# EAGLE design LED segment (EAGLE 6.5.0)
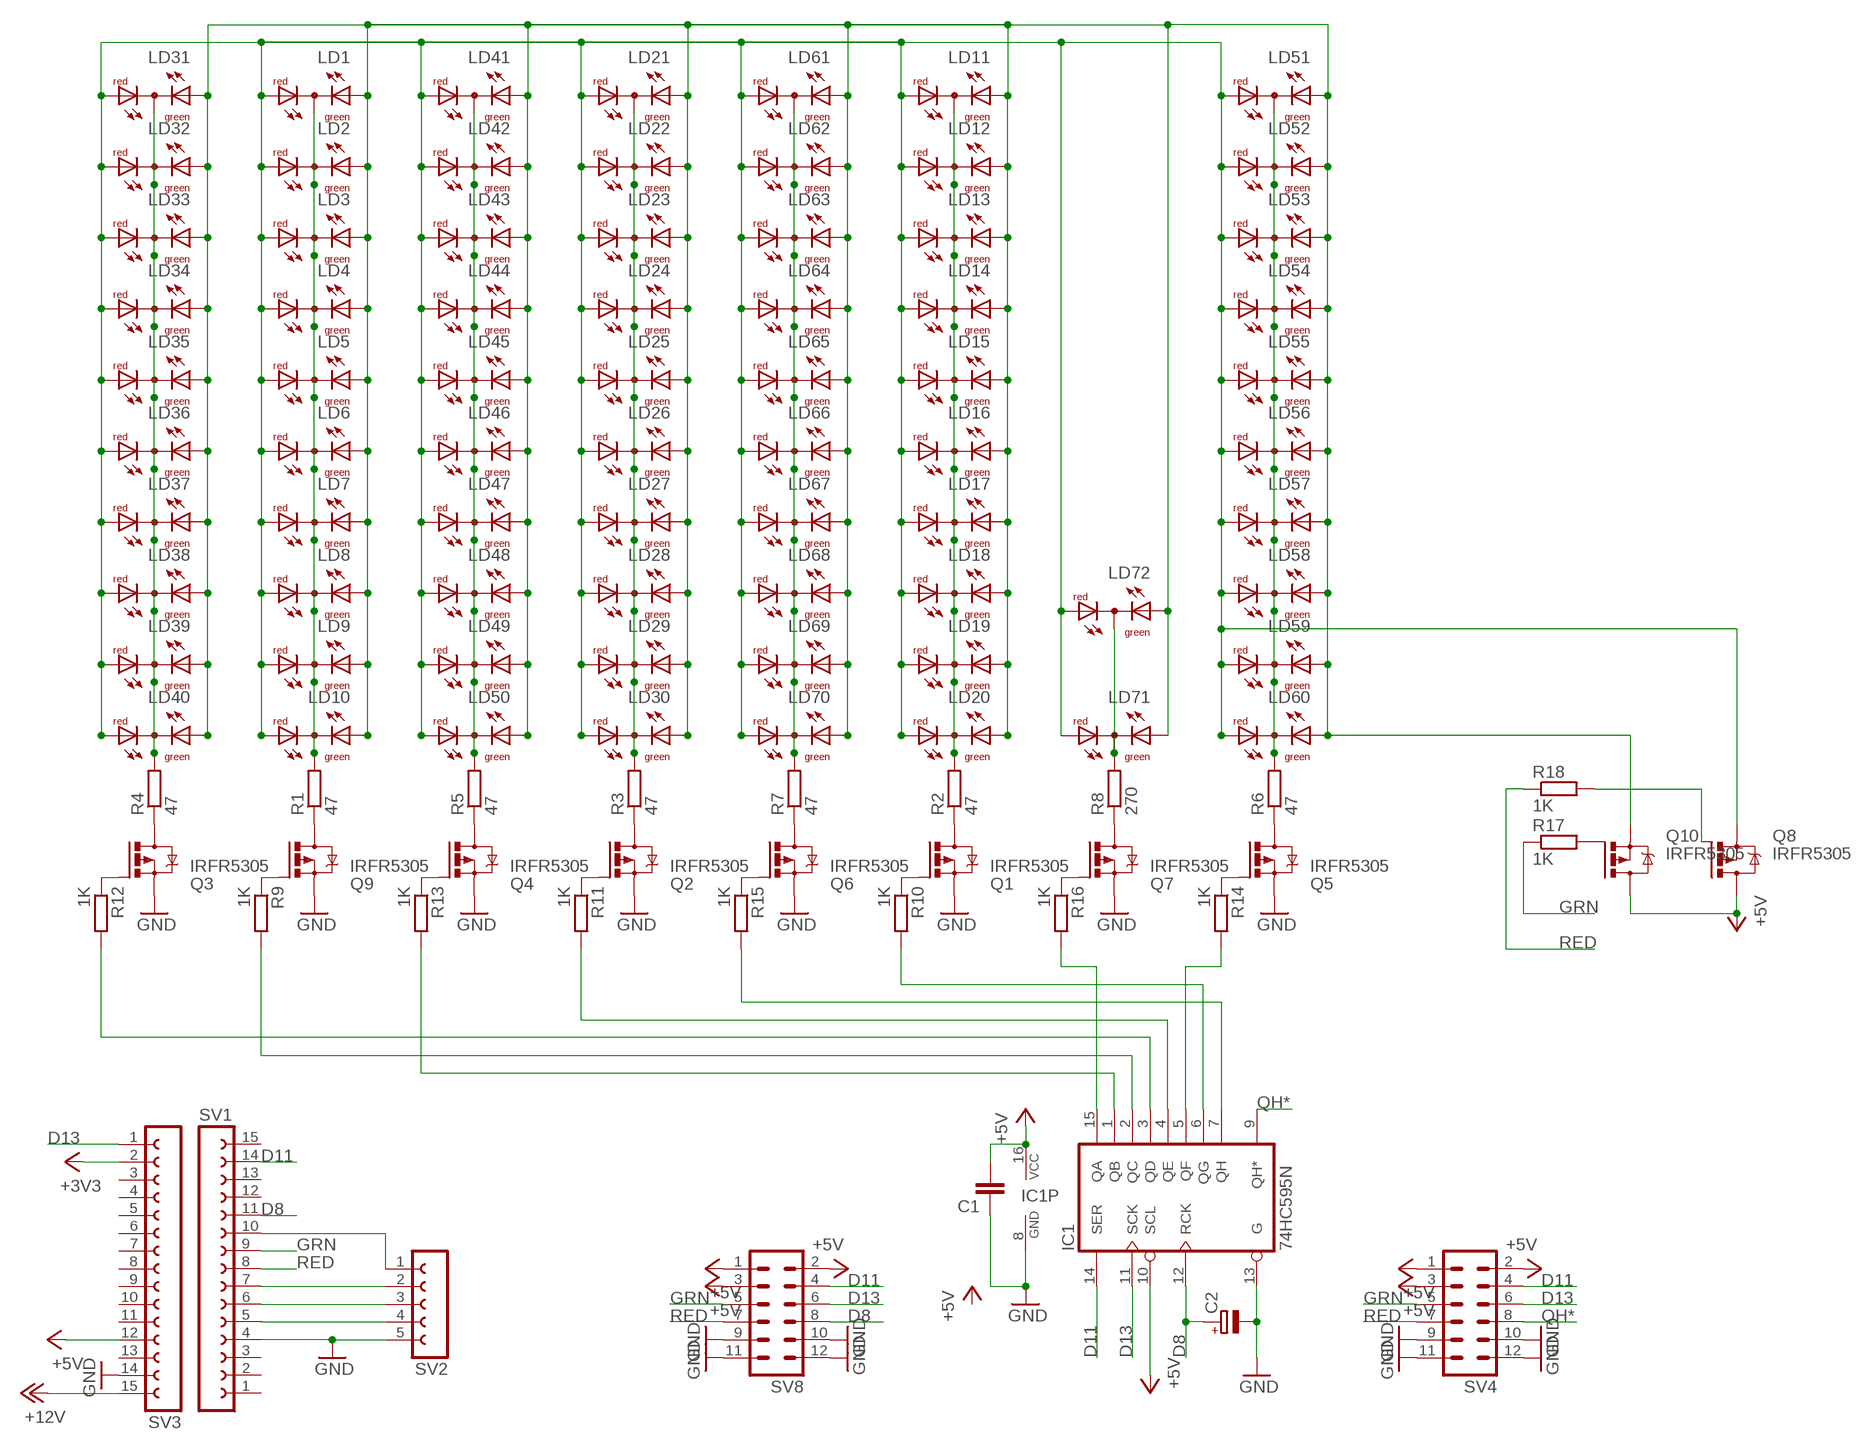
[diagram p0: schematic, sheet 1]

## Parts
C1  C-EU050-030X075  [C050-030X075]
C2  CPOL-EUE2.5-7  [E2,5-7]
IC1  74HC595N  [DIL16]
LD1  DUOLED-RG-C  [DUOLED-C-5MM]
LD2  DUOLED-RG-C  [DUOLED-C-5MM]
LD3  DUOLED-RG-C  [DUOLED-C-5MM]
LD4  DUOLED-RG-C  [DUOLED-C-5MM]
LD5  DUOLED-RG-C  [DUOLED-C-5MM]
LD6  DUOLED-RG-C  [DUOLED-C-5MM]
LD7  DUOLED-RG-C  [DUOLED-C-5MM]
LD8  DUOLED-RG-C  [DUOLED-C-5MM]
LD9  DUOLED-RG-C  [DUOLED-C-5MM]
LD10  DUOLED-RG-C  [DUOLED-C-5MM]
LD11  DUOLED-RG-C  [DUOLED-C-5MM]
LD12  DUOLED-RG-C  [DUOLED-C-5MM]
LD13  DUOLED-RG-C  [DUOLED-C-5MM]
LD14  DUOLED-RG-C  [DUOLED-C-5MM]
LD15  DUOLED-RG-C  [DUOLED-C-5MM]
LD16  DUOLED-RG-C  [DUOLED-C-5MM]
LD17  DUOLED-RG-C  [DUOLED-C-5MM]
LD18  DUOLED-RG-C  [DUOLED-C-5MM]
LD19  DUOLED-RG-C  [DUOLED-C-5MM]
LD20  DUOLED-RG-C  [DUOLED-C-5MM]
LD21  DUOLED-RG-C  [DUOLED-C-5MM]
LD22  DUOLED-RG-C  [DUOLED-C-5MM]
LD23  DUOLED-RG-C  [DUOLED-C-5MM]
LD24  DUOLED-RG-C  [DUOLED-C-5MM]
LD25  DUOLED-RG-C  [DUOLED-C-5MM]
LD26  DUOLED-RG-C  [DUOLED-C-5MM]
LD27  DUOLED-RG-C  [DUOLED-C-5MM]
LD28  DUOLED-RG-C  [DUOLED-C-5MM]
LD29  DUOLED-RG-C  [DUOLED-C-5MM]
LD30  DUOLED-RG-C  [DUOLED-C-5MM]
LD31  DUOLED-RG-C  [DUOLED-C-5MM]
LD32  DUOLED-RG-C  [DUOLED-C-5MM]
LD33  DUOLED-RG-C  [DUOLED-C-5MM]
LD34  DUOLED-RG-C  [DUOLED-C-5MM]
LD35  DUOLED-RG-C  [DUOLED-C-5MM]
LD36  DUOLED-RG-C  [DUOLED-C-5MM]
LD37  DUOLED-RG-C  [DUOLED-C-5MM]
LD38  DUOLED-RG-C  [DUOLED-C-5MM]
LD39  DUOLED-RG-C  [DUOLED-C-5MM]
LD40  DUOLED-RG-C  [DUOLED-C-5MM]
LD41  DUOLED-RG-C  [DUOLED-C-5MM]
LD42  DUOLED-RG-C  [DUOLED-C-5MM]
LD43  DUOLED-RG-C  [DUOLED-C-5MM]
LD44  DUOLED-RG-C  [DUOLED-C-5MM]
LD45  DUOLED-RG-C  [DUOLED-C-5MM]
LD46  DUOLED-RG-C  [DUOLED-C-5MM]
LD47  DUOLED-RG-C  [DUOLED-C-5MM]
LD48  DUOLED-RG-C  [DUOLED-C-5MM]
LD49  DUOLED-RG-C  [DUOLED-C-5MM]
LD50  DUOLED-RG-C  [DUOLED-C-5MM]
LD51  DUOLED-RG-C  [DUOLED-C-5MM]
LD52  DUOLED-RG-C  [DUOLED-C-5MM]
LD53  DUOLED-RG-C  [DUOLED-C-5MM]
LD54  DUOLED-RG-C  [DUOLED-C-5MM]
LD55  DUOLED-RG-C  [DUOLED-C-5MM]
LD56  DUOLED-RG-C  [DUOLED-C-5MM]
LD57  DUOLED-RG-C  [DUOLED-C-5MM]
LD58  DUOLED-RG-C  [DUOLED-C-5MM]
LD59  DUOLED-RG-C  [DUOLED-C-5MM]
LD60  DUOLED-RG-C  [DUOLED-C-5MM]
LD61  DUOLED-RG-C  [DUOLED-C-5MM]
LD62  DUOLED-RG-C  [DUOLED-C-5MM]
LD63  DUOLED-RG-C  [DUOLED-C-5MM]
LD64  DUOLED-RG-C  [DUOLED-C-5MM]
LD65  DUOLED-RG-C  [DUOLED-C-5MM]
LD66  DUOLED-RG-C  [DUOLED-C-5MM]
LD67  DUOLED-RG-C  [DUOLED-C-5MM]
LD68  DUOLED-RG-C  [DUOLED-C-5MM]
LD69  DUOLED-RG-C  [DUOLED-C-5MM]
LD70  DUOLED-RG-C  [DUOLED-C-5MM]
LD71  DUOLED-RG-C  [DUOLED-C-5MM]
LD72  DUOLED-RG-C  [DUOLED-C-5MM]
Q1  IRFR5305  [D-PAK_TO252AA]
Q2  IRFR5305  [D-PAK_TO252AA]
Q3  IRFR5305  [D-PAK_TO252AA]
Q4  IRFR5305  [D-PAK_TO252AA]
Q5  IRFR5305  [D-PAK_TO252AA]
Q6  IRFR5305  [D-PAK_TO252AA]
Q7  IRFR5305  [D-PAK_TO252AA]
Q8  IRFR5305  [D-PAK_TO252AA]
Q9  IRFR5305  [D-PAK_TO252AA]
Q10  IRFR5305  [D-PAK_TO252AA]
R1  47  R-EU_0204/7  [0204/7]
R2  47  R-EU_0204/7  [0204/7]
R3  47  R-EU_0204/7  [0204/7]
R4  47  R-EU_0204/7  [0204/7]
R5  47  R-EU_0204/7  [0204/7]
R6  47  R-EU_0204/7  [0204/7]
R7  47  R-EU_0207/5V  [0207/5V]
R8  270  R-EU_0204/7  [0204/7]
R9  1K  R-EU_0204/7  [0204/7]
R10  1K  R-EU_0204/7  [0204/7]
R11  1K  R-EU_0204/7  [0204/7]
R12  1K  R-EU_0204/7  [0204/7]
R13  1K  R-EU_0204/7  [0204/7]
R14  1K  R-EU_0204/7  [0204/7]
R15  1K  R-EU_0204/7  [0204/7]
R16  1K  R-EU_0204/7  [0204/7]
R17  1K  R-EU_0204/7  [0204/7]
R18  1K  R-EU_0204/7  [0204/7]
SV1  FE15-1  [FE15]
SV2  FE05-1  [FE05-1]
SV3  FE15-1  [FE15]
SV4  MA06-2  [MA06-2]
SV8  MA06-2  [MA06-2]

## Nets
+3V3: SV3.2
+5V: C1.2 IC1.10(SCL) IC1.16(VCC) Q8.4(D) Q10.4(D) SV3.12 SV4.1 SV4.2 SV4.3 SV8.1 SV8.2 SV8.3
+12V: SV3.15
D8: C2.+ IC1.12(RCK) SV1.11 SV8.8
D11: IC1.14(SER) SV1.14 SV4.4 SV8.4
D13: IC1.11(SCK) SV3.1 SV4.6 SV8.6
GND: C1.1 C2.- IC1.8(GND) IC1.13(G) Q1.3(S) Q2.3(S) Q3.3(S) Q4.3(S) Q5.3(S) Q6.3(S) Q7.3(S) Q9.3(S) SV1.4 SV2.5 SV3.14 SV4.9 SV4.10 SV4.11 SV4.12 SV8.9 SV8.10 SV8.11 SV8.12
GRN: R17.1 SV1.9 SV4.5 SV8.5
N$1: IC1.7(QH) R15.2
N$2: LD1.C LD2.C LD3.C LD4.C LD5.C LD6.C LD7.C LD8.C LD9.C LD10.C R1.2
N$3: IC1.5(QF) R14.2
N$4: Q9.4(D) R1.1
N$5: LD11.C LD12.C LD13.C LD14.C LD15.C LD16.C LD17.C LD18.C LD19.C LD20.C R2.2
N$6: Q1.4(D) R2.1
N$7: Q2.4(D) R3.1
N$8: LD21.C LD22.C LD23.C LD24.C LD25.C LD26.C LD27.C LD28.C LD29.C LD30.C R3.2
N$9: Q3.4(D) R4.1
N$10: Q4.4(D) R5.1
N$11: LD31.C LD32.C LD33.C LD34.C LD35.C LD36.C LD37.C LD38.C LD39.C LD40.C R4.2
N$12: Q5.4(D) R6.1
N$13: Q6.4(D) R7.1
N$14: LD41.C LD42.C LD43.C LD44.C LD45.C LD46.C LD47.C LD48.C LD49.C LD50.C R5.2
N$15: Q7.4(D) R8.1
N$16: LD51.C LD52.C LD53.C LD54.C LD55.C LD56.C LD57.C LD58.C LD59.C LD60.C R6.2
N$18: LD1.AR LD2.AR LD3.AR LD4.AR LD5.AR LD6.AR LD7.AR LD8.AR LD9.AR LD10.AR LD11.AR LD12.AR LD13.AR LD14.AR LD15.AR LD16.AR LD17.AR LD18.AR LD19.AR LD20.AR LD21.AR LD22.AR LD23.AR LD24.AR LD25.AR LD26.AR LD27.AR LD28.AR LD29.AR LD30.AR LD31.AR LD32.AR LD33.AR LD34.AR LD35.AR LD36.AR LD37.AR LD38.AR LD39.AR LD40.AR LD41.AR LD42.AR LD43.AR LD44.AR LD45.AR LD46.AR LD47.AR LD48.AR LD49.AR LD50.AR LD51.AR LD52.AR LD53.AR LD54.AR LD55.AR LD56.AR LD57.AR LD58.AR LD59.AR LD60.AR LD61.AR LD62.AR LD63.AR LD64.AR LD65.AR LD66.AR LD67.AR LD68.AR LD69.AR LD70.AR LD71.AR LD72.AR Q8.3(S)
N$19: LD1.AX(AG) LD2.AX(AG) LD3.AX(AG) LD4.AX(AG) LD5.AX(AG) LD6.AX(AG) LD7.AX(AG) LD8.AX(AG) LD9.AX(AG) LD10.AX(AG) LD11.AX(AG) LD12.AX(AG) LD13.AX(AG) LD14.AX(AG) LD15.AX(AG) LD16.AX(AG) LD17.AX(AG) LD18.AX(AG) LD19.AX(AG) LD20.AX(AG) LD21.AX(AG) LD22.AX(AG) LD23.AX(AG) LD24.AX(AG) LD25.AX(AG) LD26.AX(AG) LD27.AX(AG) LD28.AX(AG) LD29.AX(AG) LD30.AX(AG) LD31.AX(AG) LD32.AX(AG) LD33.AX(AG) LD34.AX(AG) LD35.AX(AG) LD36.AX(AG) LD37.AX(AG) LD38.AX(AG) LD39.AX(AG) LD40.AX(AG) LD41.AX(AG) LD42.AX(AG) LD43.AX(AG) LD44.AX(AG) LD45.AX(AG) LD46.AX(AG) LD47.AX(AG) LD48.AX(AG) LD49.AX(AG) LD50.AX(AG) LD51.AX(AG) LD52.AX(AG) LD53.AX(AG) LD54.AX(AG) LD55.AX(AG) LD56.AX(AG) LD57.AX(AG) LD58.AX(AG) LD59.AX(AG) LD60.AX(AG) LD61.AX(AG) LD62.AX(AG) LD63.AX(AG) LD64.AX(AG) LD65.AX(AG) LD66.AX(AG) LD67.AX(AG) LD68.AX(AG) LD69.AX(AG) LD70.AX(AG) LD71.AX(AG) LD72.AX(AG) Q10.3(S)
N$20: LD61.C LD62.C LD63.C LD64.C LD65.C LD66.C LD67.C LD68.C LD69.C LD70.C R7.2
N$22: LD71.C LD72.C R8.2
N$24: IC1.1(QB) R13.2
N$25: Q9.1(G) R9.1
N$26: Q1.1(G) R10.1
N$27: Q2.1(G) R11.1
N$28: Q3.1(G) R12.1
N$29: Q4.1(G) R13.1
N$30: Q5.1(G) R14.1
N$31: Q6.1(G) R15.1
N$32: Q7.1(G) R16.1
N$34: IC1.15(QA) R16.2
N$35: IC1.6(QG) R10.2
N$37: IC1.4(QE) R11.2
N$38: IC1.3(QD) R12.2
N$39: IC1.2(QC) R9.2
N$41: Q10.1(G) R17.2
N$42: Q8.1(G) R18.2
N$50: SV1.7 SV2.2
N$51: SV1.6 SV2.3
N$52: SV1.5 SV2.4
N$53: SV1.10 SV2.1
QH*: IC1.9(QH*) SV4.8
RED: R18.1 SV1.8 SV4.7 SV8.7
Unconnected: SV1.1 SV1.2 SV1.3 SV1.12 SV1.13 SV1.15 SV3.3 SV3.4 SV3.5 SV3.6 SV3.7 SV3.8 SV3.9 SV3.10 SV3.11 SV3.13

## Library data of the parts
C1 = rcl:C-EU: CAPACITOR, European symbol
C2 = rcl:CPOL-EU: POLARIZED CAPACITOR, European symbol
IC1 = 74xx-eu:74*595: 8-bit SHIFT REGISTER, output latch
LD1-LD72 = led:DUOLED-RG-C: DUO LED 2 colors (red/green), 5 mm, round, common Cathode www.ligitek.com or other producers.
Q1-Q10 = transistor-power:IRF?5305: HEXFET Power MOSFET Source: http://www.irf.com/product-info/datasheets/data/irfr5305pbf.pdf
R1-R18 = resistor:R-EU_: RESISTOR, European symbol
SV1 SV3 = con-lsta:FE15-1: FEMALE HEADER; OC_FARNELL: unknown; OC_NEWARK: unknown
SV2 = con-lsta:FE05-1: FEMALE HEADER; OC_FARNELL: unknown; OC_NEWARK: unknown
SV4 SV8 = con-lstb:MA06-2: PIN HEADER; OC_FARNELL: unknown; OC_NEWARK: unknown

## Board
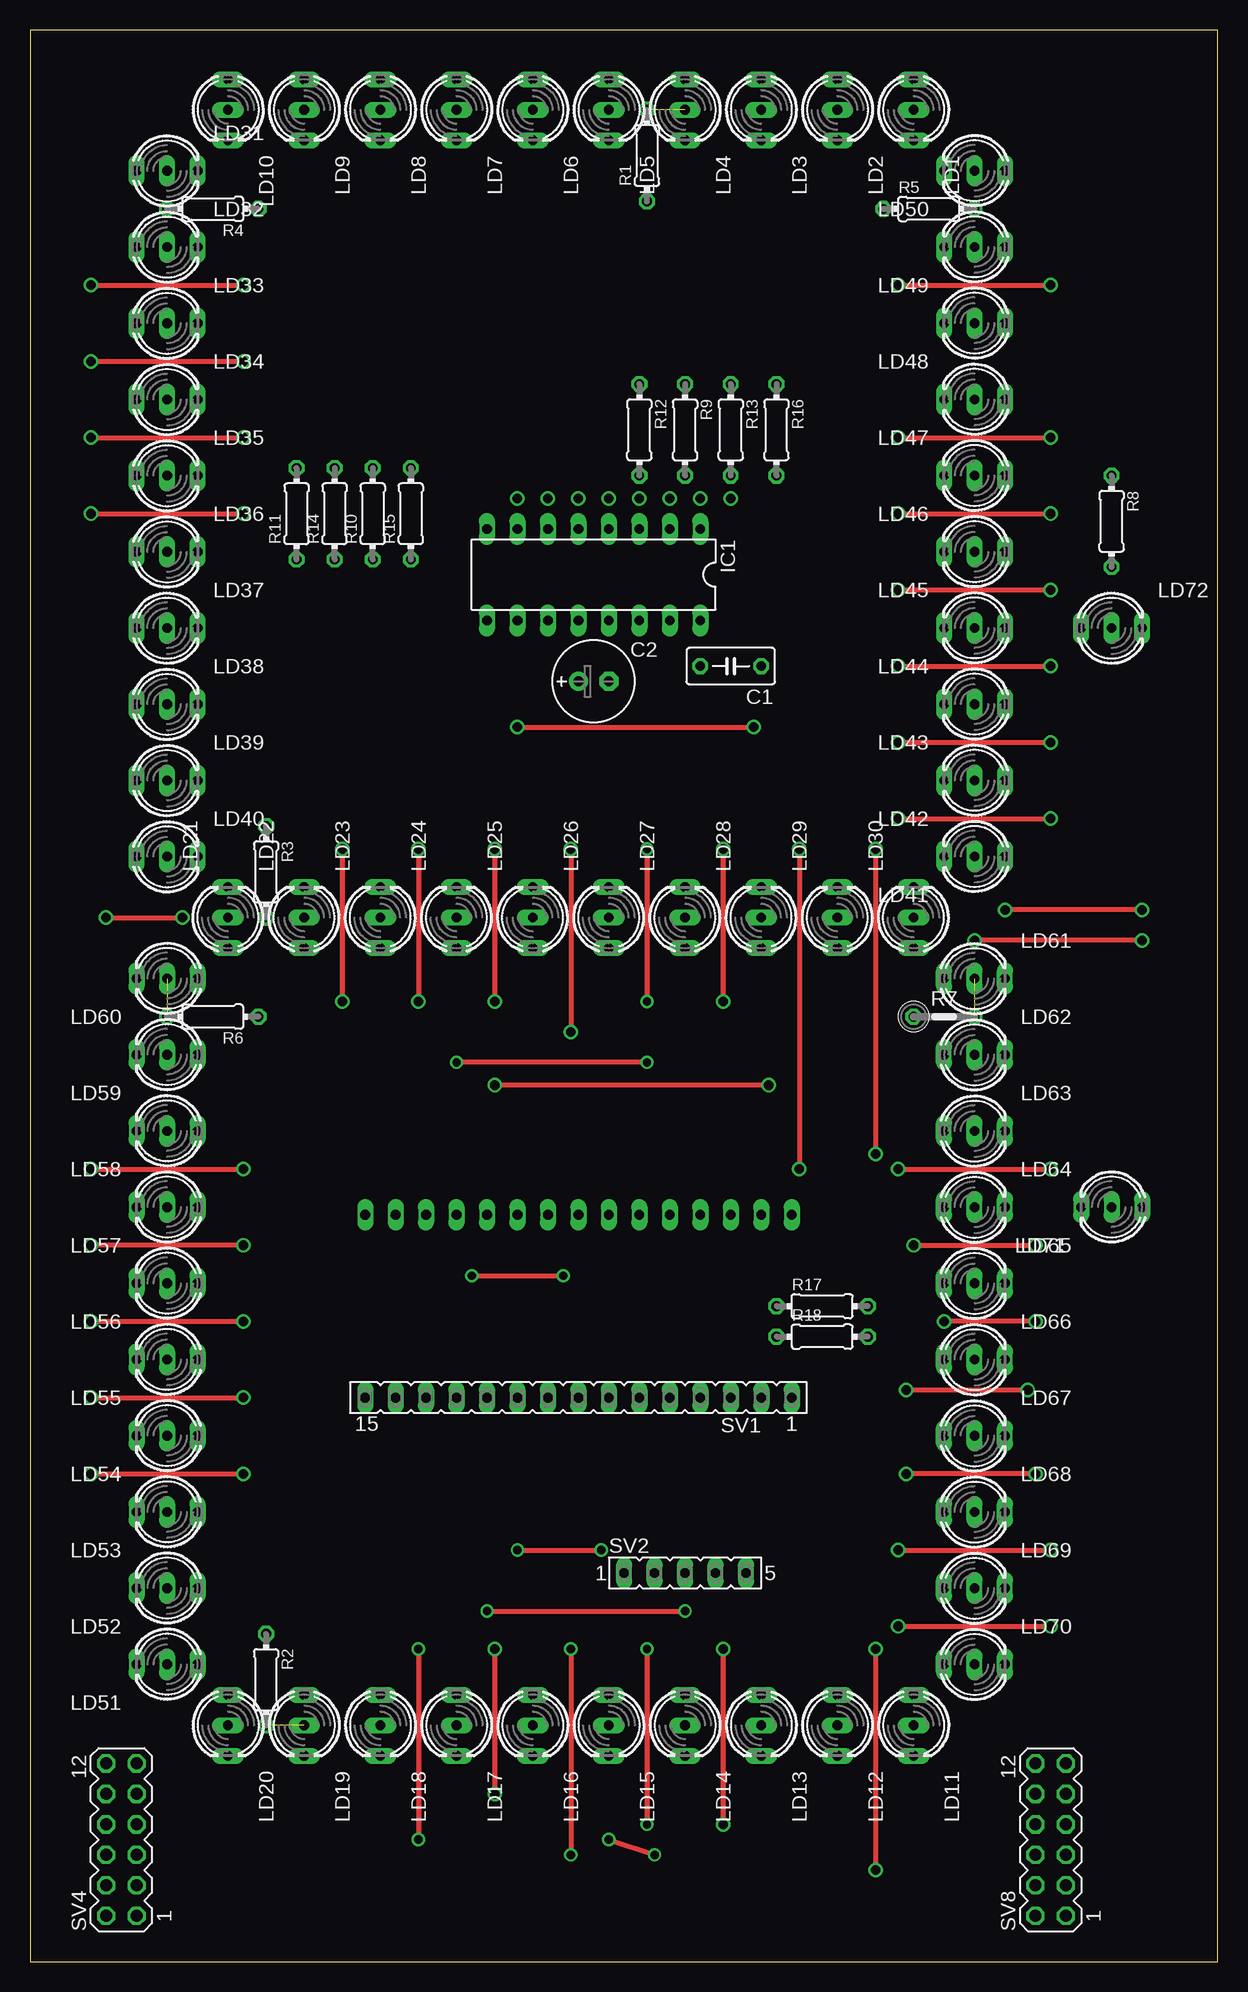
[diagram p1: board, top side]
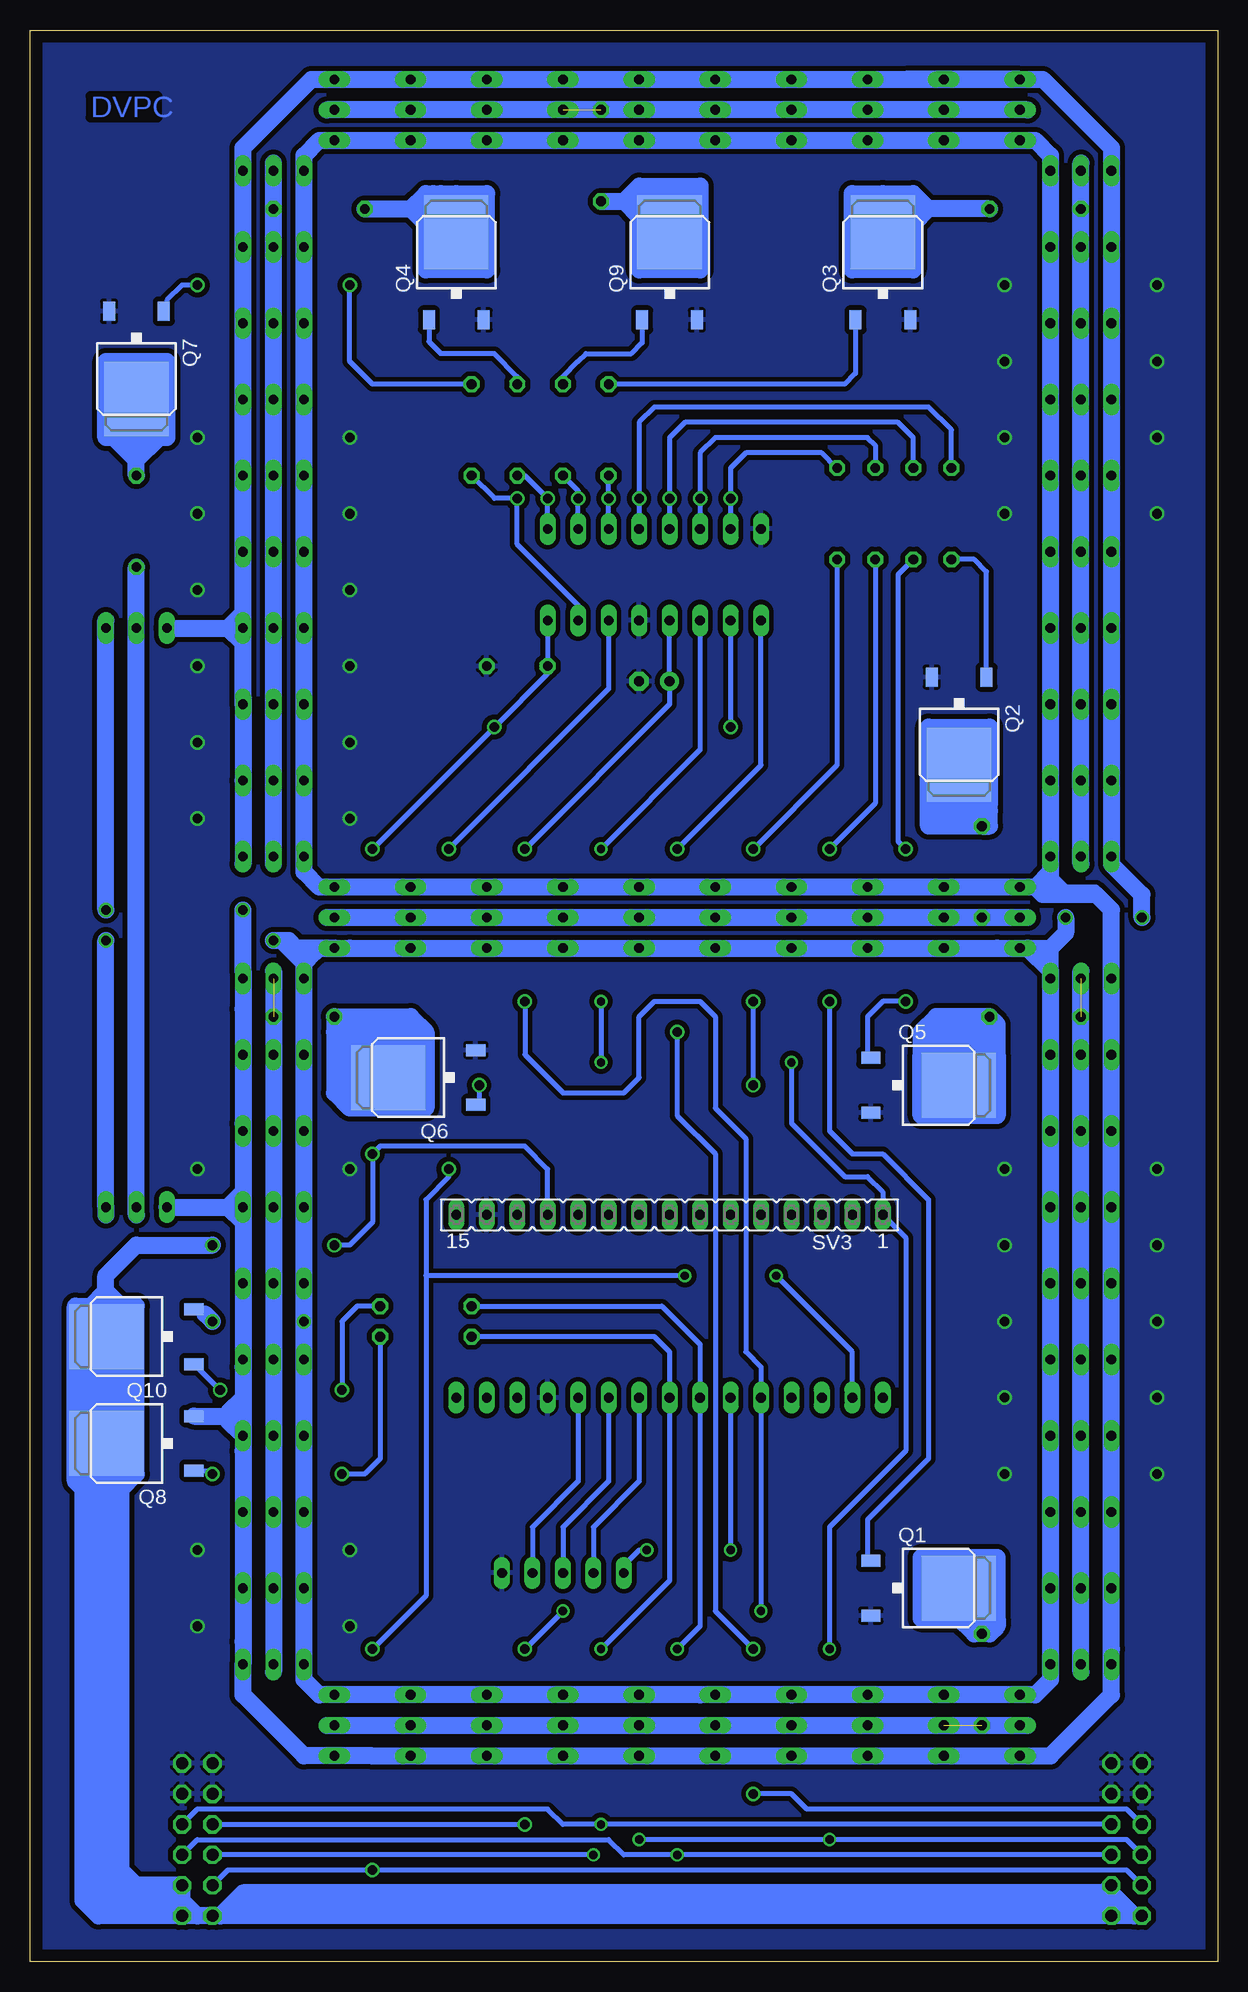
[diagram p2: board, bottom side, seen from below]

Size 99.04 x 160.96 mm. Coordinates in mm from the lower left corner, seen from the top.
Outline: 0,0 99.04,0 99.04,160.96 0,160.96 0,0
Copper layers (1*16): Top 0.035mm / dielectric 1.5mm / Bottom 0.035mm
Design rules "default": minimum track width 10mil, minimum drill 24mil, track to track 8mil, track to pad 8mil, pad to pad 8mil, via to via 8mil, smd to smd 8mil, copper to edge 40mil, drill to drill 8mil, minimum pad ring 10mil, minimum via ring 8mil, stop-mask expansion 4mil, vias tented up to drill 0mil, thermal gap 10mil

### Footprints (pad centres in the part's own frame; a part is rotated, then mirrored left to right if it is on the bottom)
C050-030X075 = drill 0.813 octagon: 1 -2.54,0; 2 2.54,0
E2,5-7 = drill 0.813 pad 1.6: + -1.27,0 | drill 0.813 pad 1.6 octagon: - 1.27,0
DIL16 = drill 0.813 long: 1 -8.89,-3.81; 2 -6.35,-3.81; 3 -3.81,-3.81; 4 -1.27,-3.81; 5 1.27,-3.81; 6 3.81,-3.81; 7 6.35,-3.81; 8 8.89,-3.81; 9 8.89,3.81; 10 6.35,3.81; 11 3.81,3.81; 12 1.27,3.81; 13 -1.27,3.81; 14 -3.81,3.81; 15 -6.35,3.81; 16 -8.89,3.81
DUOLED-C-5MM = drill 0.813 long: AR 2.54,0; AX -2.54,0; C 0,0
D-PAK_TO252AA = smd 1 x 1.6: 1 -2.28,-4.8; 3 2.28,-4.8 | smd 5.4 x 6.2: 4 0,2.5
0204/7 = drill 0.813 octagon: 1 -3.81,0; 2 3.81,0
0207/5V = drill 0.813 octagon: 1 -2.54,0; 2 2.54,0
FE15 = drill 0.813 long: 1 -17.78,0; 2 -15.24,0; 3 -12.7,0; 4 -10.16,0; 5 -7.62,0; 6 -5.08,0; 7 -2.54,0; 8 0,0; 9 2.54,0; 10 5.08,0; 11 7.62,0; 12 10.16,0; 13 12.7,0; 14 15.24,0; 15 17.78,0
FE05-1 = drill 0.813 long: 1 -5.08,0; 2 -2.54,0; 3 0,0; 4 2.54,0; 5 5.08,0
MA06-2 = drill 1.016 octagon: 1 -6.35,-1.27; 2 -6.35,1.27; 3 -3.81,-1.27; 4 -3.81,1.27; 5 -1.27,-1.27; 6 -1.27,1.27; 7 1.27,-1.27; 8 1.27,1.27; 9 3.81,-1.27; 10 3.81,1.27; 11 6.35,-1.27; 12 6.35,1.27

### Placement (x,y rotation side)
C1  58.42,107.95 180 top
C2  46.99,106.68 0 top
IC1  46.99,115.57 180 top
LD1  73.66,154.31 270 top
LD2  67.31,154.31 270 top
LD3  60.96,154.31 270 top
LD4  54.61,154.31 270 top
LD5  48.26,154.31 270 top
LD6  41.91,154.31 270 top
LD7  35.56,154.31 270 top
LD8  29.21,154.31 270 top
LD9  22.86,154.31 270 top
LD10  16.51,154.31 270 top
LD11  73.66,19.68 270 top
LD12  67.31,19.68 270 top
LD13  60.96,19.68 270 top
LD14  54.61,19.68 270 top
LD15  48.26,19.68 270 top
LD16  41.91,19.68 270 top
LD17  35.56,19.68 270 top
LD18  29.21,19.68 270 top
LD19  22.86,19.68 270 top
LD20  16.51,19.68 270 top
LD21  16.51,87 90 top
LD22  22.86,87 90 top
LD23  29.21,87 90 top
LD24  35.56,87 90 top
LD25  41.91,87 90 top
LD26  48.26,87 90 top
LD27  54.61,87 90 top
LD28  60.96,87 90 top
LD29  67.31,87 90 top
LD30  73.66,87 90 top
LD31  11.43,149.22 0 top
LD32  11.43,142.88 0 top
LD33  11.43,136.53 0 top
LD34  11.43,130.18 0 top
LD35  11.43,123.83 0 top
LD36  11.43,117.47 0 top
LD37  11.43,111.12 0 top
LD38  11.43,104.78 0 top
LD39  11.43,98.42 0 top
LD40  11.43,92.08 0 top
LD41  78.74,92.08 180 top
LD42  78.74,98.42 180 top
LD43  78.74,104.78 180 top
LD44  78.74,111.12 180 top
LD45  78.74,117.47 180 top
LD46  78.74,123.83 180 top
LD47  78.74,130.18 180 top
LD48  78.74,136.53 180 top
LD49  78.74,142.88 180 top
LD50  78.74,149.22 180 top
LD51  11.43,24.77 180 top
LD52  11.43,31.11 180 top
LD53  11.43,37.47 180 top
LD54  11.43,43.81 180 top
LD55  11.43,50.16 180 top
LD56  11.43,56.52 180 top
LD57  11.43,62.87 180 top
LD58  11.43,69.22 180 top
LD59  11.43,75.56 180 top
LD60  11.43,81.92 180 top
LD61  78.74,81.92 0 top
LD62  78.74,75.56 0 top
LD63  78.74,69.22 0 top
LD64  78.74,62.87 0 top
LD65  78.74,56.52 0 top
LD66  78.74,50.16 0 top
LD67  78.74,43.81 0 top
LD68  78.74,37.47 0 top
LD69  78.74,31.11 0 top
LD70  78.74,24.77 0 top
LD71  90.17,62.87 180 top
LD72  90.17,111.12 0 top
Q1  24.13,31.11 270 bottom
Q2  21.59,102.23 180 bottom
Q3  27.94,141.6 0 bottom
Q4  63.5,141.6 0 bottom
Q5  24.13,73.03 270 bottom
Q6  66.67,73.66 90 bottom
Q7  90.17,132.72 180 bottom
Q8  90.17,43.18 90 bottom
Q9  45.72,141.6 0 bottom
Q10  90.17,52.07 90 bottom
R1  51.44,150.5 90 top
R2  19.68,23.5 270 top
R3  19.68,90.81 270 top
R4  15.24,146.05 180 top
R5  74.93,146.05 0 top
R6  15.24,78.74 180 top
R7  76.2,78.74 0 top
R8  90.17,120.02 270 top
R9  54.61,127.64 270 top
R10  28.57,120.65 90 top
R11  22.23,120.65 90 top
R12  50.8,127.64 270 top
R13  58.42,127.64 270 top
R14  25.4,120.65 90 top
R15  31.75,120.65 90 top
R16  62.23,127.64 270 top
R17  66.04,54.61 0 top
R18  66.04,52.07 0 top
SV1  45.72,46.99 180 top
SV2  54.61,32.38 0 top
SV3  45.72,62.23 180 bottom
SV4  7.62,10.16 90 top
SV8  85.09,10.16 90 top

### Tracks (layer width: path | path; a pad name or v marks a point on that pad's centre or on a via)
+5V  (via drill 0.8)
  Top 0.406: v70.48,92.71 v70.48,67.31 | v40.64,102.87 v60.33,102.87 | v73.66,59.69 v83.82,59.69
  Bottom 0.406: IC1.16 C1.2 55.88,107.31 v60.33,102.87 v70.48,92.71 | IC1.10 v40.64,102.87 | SV4.2 SV4.1 | 8.89,5.71 SV4.1 | SV4.1 83.19,3.81 | 86.36,5.08 SV8.1 90.17,3.81 91.44,5.08 92.71,6.35 92.71,35.56 92.71,43.14 Q8.4 Q10.4 92.71,52.11 92.71,53.34 92.71,55.88 | v73.66,59.69 72.39,59.69 70.48,61.59 v70.48,67.31 69.85,67.94 57.78,67.94 55.88,66.04 SV3.12
  Bottom 1.422: 83.19,3.81 SV4.2 6.99,3.81 8.89,5.71 SV4.3 9.53,5.71 81.28,5.71 83.19,3.81 | 83.19,3.81 SV8.2 85.09,3.81 | 85.09,3.81 SV8.1 93.34,3.81 94.61,5.08 94.61,39.37 | 85.09,3.81 86.36,5.08 | 86.36,5.08 SV8.3 90.17,6.35 | 94.61,39.37 94.61,52.07 93.98,52.7 | 90.17,6.35 91.44,7.62 91.44,39.37 | 91.44,39.37 90.17,40.64 90.17,54.61 91.44,54.61 | 86.36,5.08 91.44,5.08 | 91.44,5.08 92.71,5.08 93.98,6.35 93.98,7.62 | 93.98,7.62 93.98,35.56 | 93.98,35.56 92.71,35.56 | 92.71,35.56 92.71,7.62 91.44,6.35 | 92.71,6.35 93.98,7.62 | 91.44,5.08 90.17,6.35 | 93.98,35.56 93.98,52.07 92.71,53.34 | 92.71,35.56 92.71,50.8 | 91.44,39.37 91.44,54.61 | 94.61,39.37 95.25,40.01 95.25,54.61 93.98,54.61 | 91.44,54.61 93.98,54.61 | 93.98,54.61 92.71,55.88 | 91.44,54.61 92.71,55.88 | 92.71,55.88 92.71,57.15 90.17,59.69 v83.82,59.69
D8  (via drill 0.7, 0.8)
  Top 0.406: v57.78,92.71 v57.78,80.01 | v57.78,26.04 v57.78,11.43 | v38.1,29.21 v54.61,29.21
  Bottom 0.406: IC1.12 C2.+ 45.72,104.78 v57.78,92.71 | v54.61,29.21 v57.78,26.04 | SV8.8 v57.78,11.43 | v38.1,29.21 SV1.11 38.1,49.53 39.37,50.8 39.37,68.58 41.91,71.12 41.91,78.74 43.18,80.01 46.99,80.01 48.26,78.74 48.26,73.66 49.53,72.39 54.61,72.39 57.78,75.56 v57.78,80.01
D11  (via drill 0.7, 0.8)
  Top 0.406: v64.14,92.71 v64.14,66.04 | v70.48,26.04 v70.48,7.62 | v36.83,57.15 v44.45,57.15
  Bottom 0.406: IC1.14 50.8,106.05 v64.14,92.71 | v64.14,66.04 64.14,65.41 66.04,63.5 66.04,57.15 | SV4.4 7.62,7.62 v70.48,7.62 82.55,7.62 SV8.4 | SV1.14 30.48,50.8 v36.83,57.15 | v44.45,57.15 66.04,57.15 | 66.04,57.15 66.04,30.48 v70.48,26.04
D13  (via drill 0.7)
  Top 0.406: v51.44,92.71 v51.44,80.01 | v51.44,74.93 v35.56,74.93 | v32.38,26.04 v32.38,10.16 | v48.26,10.16 v52.07,8.89
  Bottom 0.406: IC1.11 43.18,100.97 v51.44,92.71 | v51.44,80.01 v51.44,74.93 | v35.56,74.93 35.56,69.85 31.11,65.41 29.21,65.41 27.94,64.14 SV3.1 26.04,60.33 26.04,42.55 32.38,36.2 v32.38,26.04 | SV4.6 7.62,10.16 v32.38,10.16 v48.26,10.16 | v52.07,8.89 SV8.6
GND  (via drill 0.8)
  Top 0.406: v5.08,66.04 v17.78,66.04 | v17.78,59.69 v5.08,59.69 | v5.08,53.34 v17.78,53.34 | v5.08,46.99 v17.78,46.99 | v5.08,40.64 v17.78,40.64 | v5.08,139.7 v17.78,139.7 | v5.08,133.35 v17.78,133.35 | v5.08,127 v17.78,127 | v5.08,120.65 v17.78,120.65 | v72.39,127 v85.09,127 | v72.39,120.65 v85.09,120.65 | v72.39,114.3 v85.09,114.3 | v72.39,107.95 v85.09,107.95 | v72.39,101.6 v85.09,101.6 | v72.39,95.25 v85.09,95.25 | v72.39,66.04 v85.09,66.04 | v72.39,34.29 v85.09,34.29 | v72.39,27.94 v85.09,27.94
  pour Bottom (isolate 0.406): 0,161.29 0,0 99.06,0 99.06,161.29
GRN  (via drill 0.7)
  Top 0.406: v45.09,26.04 v45.09,8.89
  Bottom 0.406: SV4.5 v45.09,8.89 49.53,8.89 50.8,10.16 85.09,10.16 SV8.5 | v45.09,26.04 43.18,27.94 SV1.9 43.18,51.44 46.35,54.61 R17.1
N$1  (via drill 0.8)
  Bottom 0.406: R15.2 33.02,125.73 39.37,125.73 40.64,124.46 v40.64,121.92 IC1.7
N$2  (1 unrouted)
  Bottom 0.406: LD1.C LD2.C LD3.C LD4.C LD5.C LD6.C LD7.C LD8.C LD9.C LD10.C
N$3  (via drill 0.8)
  Bottom 0.406: R14.2 25.4,127 26.67,128.27 44.45,128.27 45.72,127 v45.72,121.92 IC1.5
N$4
  Bottom 0.406: 45.68,144.15 Q9.4 48.3,146.69 50.8,146.69
  Bottom 1.422: 48.26,145.41 48.26,140.97 43.18,140.97 43.18,146.69 43.18,147.32 | 48.26,145.41 48.26,147.32 | 48.26,147.32 43.18,147.32 | 48.26,147.32 48.9,146.69 50.8,146.69 R1.1 | 48.26,145.41 49.53,146.69 48.26,147.96 43.18,147.96 43.18,147.32
N$5  (1 unrouted)
  Bottom 0.406: LD20.C LD19.C LD18.C LD17.C LD16.C LD15.C LD14.C LD13.C LD12.C LD11.C
N$6
  Bottom 0.406: 21.59,31.75 21.59,31.16 Q1.4 19.68,29.17 | R2.1 19.68,29.17 | 18.41,28.57 19.09,28.57 19.68,29.17
  Bottom 1.422: 21.59,28.57 24.77,28.57 24.77,33.66 18.41,33.66 18.41,28.57 | 21.59,28.57 18.41,28.57 | 18.41,28.57 18.41,27.94 19.05,27.3 20.32,27.3 21.59,28.57
N$7
  Bottom 0.406: 24.13,99.69 21.63,99.69 Q2.4 21.59,99.06 19.68,97.16 19.68,96.52 R3.1
  Bottom 1.422: 19.05,96.52 19.05,102.87 24.13,102.87 24.13,96.52 | 19.05,96.52 19.68,96.52 24.13,96.52 | 24.13,96.52 24.13,94.61 R3.1 19.05,94.61 19.05,95.89 | 19.05,95.89 19.05,96.52 | 19.05,95.89 22.86,95.89 23.5,95.25
N$8
  Bottom 0.406: LD30.C LD29.C LD28.C LD27.C LD26.C LD25.C LD24.C LD23.C LD22.C R3.2 LD21.C
N$9
  Bottom 0.406: Q3.4 27.94,146.05 R4.1
  Bottom 1.422: 27.94,147.32 27.94,146.05 27.94,142.88 | 27.94,147.32 30.48,147.32 30.48,140.97 25.4,140.97 25.4,144.78 | 27.94,147.32 25.4,147.32 | 25.4,147.32 25.4,144.78 | 24.13,146.05 25.4,144.78 | R4.1 24.13,146.05 | 24.13,146.05 25.4,147.32
N$10
  Bottom 0.406: Q4.4 63.46,144.15 63.46,146.05 | 63.46,146.05 63.46,147.28 63.5,147.32 | 67.31,146.05 63.46,146.05
  Bottom 1.422: 63.5,144.15 63.46,144.15 62.87,144.15 | 66.67,146.05 65.41,147.32 | 65.41,147.32 64.77,147.32 63.5,147.32 60.96,147.32 60.96,140.97 66.04,140.97 66.04,144.78 67.31,146.05 | R5.1 67.31,146.05 | 67.31,146.05 66.67,146.05 | 66.67,146.05 65.41,144.78 | 67.31,146.05 66.04,147.32 65.41,147.32
N$11
  Bottom 0.406: LD40.C LD39.C LD38.C LD37.C LD36.C LD35.C LD34.C LD33.C LD32.C R4.2 LD31.C
N$12
  Bottom 0.406: Q5.4 20.95,73.03 19.05,74.93 | R6.1 19.05,74.93 | 19.05,74.93 18.41,74.93
  Bottom 1.422: 24.77,75.56 24.77,70.48 18.41,70.48 18.41,74.93 18.41,75.56 | 24.77,75.56 19.68,75.56 | 19.68,75.56 18.41,75.56 | 18.41,75.56 18.41,78.11 R6.1 23.5,78.74 24.77,77.47 24.77,75.56 | 19.68,75.56 19.68,78.11 22.86,78.11 24.13,76.83 20.95,76.83 20.32,76.2
N$13
  Bottom 0.406: Q6.4 71.12,75.61 71.12,76.2 69.85,74.93
  Bottom 1.422: 69.22,75.56 69.85,74.93 | 66.04,76.2 66.04,71.12 72.39,71.12 | 72.39,71.12 72.39,76.2 | 72.39,76.2 71.12,76.2 67.31,76.2 | 67.31,76.2 66.04,76.2 | R7.1 67.31,78.74 66.04,77.47 66.04,76.2 | 67.31,76.2 67.31,77.47 72.39,77.47 R7.1 | R7.1 73.66,77.47 72.39,76.2 | R7.1 73.66,72.39 72.39,71.12
N$14
  Bottom 0.406: LD41.C LD42.C LD43.C LD44.C LD45.C LD46.C LD47.C LD48.C LD49.C R5.2 | 78.74,148.59 LD50.C
  Bottom 1.422: R5.2 78.74,148.59 | 78.74,148.59 78.74,149.86 | 78.74,91.44 78.74,148.59
N$15
  Bottom 0.406: 90.17,127.64 Q7.4 90.17,130.81 92.71,133.35
  Bottom 1.422: 88.27,127 87.63,127 87.63,133.35 92.71,133.35 92.71,127 92.08,127 | 88.27,127 92.08,127 | 90.17,127.64 R8.1 90.17,125.09 | 90.17,125.09 88.27,127 | 90.17,125.09 92.08,127
N$16  (1 unrouted)
  Bottom 0.406: LD51.C LD52.C LD53.C LD54.C LD55.C LD56.C LD57.C LD58.C LD59.C LD60.C
N$17
  pour Bottom (isolate 0.406): 13.97,83.82 13.97,22.86 76.2,22.86 76.2,83.82
N$18  (via drill 0.8)
  Top 0.406: v92.71,87.63 v81.28,87.63
  Bottom 0.406: LD43.AR LD44.AR | LD11.AR 70.48,17.14 LD12.AR LD13.AR LD14.AR LD15.AR | LD16.AR 39.37,17.14 | 38.1,17.14 LD17.AR LD18.AR LD19.AR LD20.AR 13.97,17.14 | 8.89,26.04 LD52.AR LD53.AR LD54.AR LD55.AR LD56.AR LD57.AR LD58.AR LD59.AR LD60.AR 8.89,88.27 10.16,89.53 13.97,89.53 14.61,90.17 | 14.61,90.17 15.24,89.53 LD21.AR 19.05,89.53 LD22.AR LD23.AR LD24.AR LD25.AR LD26.AR LD27.AR 60.33,89.53 LD28.AR LD29.AR 69.22,89.53 LD30.AR 74.93,89.53 | 14.61,90.17 13.97,90.81 | LD40.AR LD39.AR LD38.AR LD37.AR LD36.AR LD35.AR LD34.AR | 13.97,131.44 LD34.AR | LD34.AR LD33.AR LD32.AR LD31.AR 13.97,150.5 | 15.24,151.76 LD10.AR LD9.AR LD8.AR LD7.AR LD6.AR LD5.AR LD4.AR LD3.AR LD2.AR LD1.AR 74.93,151.76 | 76.2,150.5 LD50.AR LD49.AR LD48.AR LD47.AR LD46.AR LD45.AR LD44.AR | LD44.AR LD42.AR LD41.AR 76.2,90.81 | 81.28,26.67 LD69.AR LD68.AR 81.28,42.55 | LD67.AR 81.28,45.72 81.54,45.46 | 81.28,49.53 LD66.AR LD65.AR 81.28,61.59 | 81.28,64.14 LD63.AR 81.28,69.85 LD62.AR 81.28,79.38 LD61.AR | LD72.AR v92.71,87.63 | LD51.AR 8.89,22.23
  Bottom 1.422: LD40.AR 13.97,150.5 15.24,151.76 74.93,151.76 76.2,150.5 76.2,90.81 74.93,89.53 69.22,89.53 60.33,89.53 19.05,89.53 15.24,89.53 | LD40.AR 13.97,90.81 15.24,89.53 | 81.28,64.14 81.28,69.85 81.28,79.38 81.28,82.55 v81.28,87.63 | 81.28,64.14 LD64.AR | LD64.AR 81.28,61.59 | 81.28,61.59 81.28,49.53 81.28,45.72 81.28,42.55 81.28,26.67 LD70.AR 81.28,22.23 76.2,17.14 70.48,17.14 39.37,17.14 38.1,17.14 13.97,17.14 8.89,22.23 8.89,26.04 8.89,87.63 10.16,88.9 12.7,88.9 | 12.7,88.9 13.97,88.9 | 15.24,89.53 14.61,89.53 13.97,88.9 | LD40.AR 13.97,90.17 12.7,88.9 | 13.97,88.9 14.61,88.9 15.24,89.53 | Q8.3 81.54,45.46 | LD67.AR 82.55,45.09 82.55,45.72 81.28,46.99 | LD71.AR 82.55,62.87 | 82.55,62.87 LD64.AR | 82.55,62.87 81.28,64.14 | 82.55,62.87 81.28,61.59 | v92.71,87.63 92.71,111.76
N$19  (via drill 0.8)
  Top 0.406: v6.35,87 v12.7,87 | v92.71,85.09 v78.74,85.09 | v83.82,53.34 v76.2,53.34
  Bottom 0.406: 15.24,22.23 LD20.AX LD19.AX LD18.AX LD17.AX LD16.AX 43.18,22.23 LD15.AX | 13.97,23.5 LD51.AX LD52.AX LD53.AX LD54.AX | LD14.AX LD13.AX LD12.AX LD11.AX 74.93,22.23 | 76.2,23.5 LD70.AX LD69.AX LD68.AX LD67.AX LD66.AX v76.2,53.34 | 76.2,54.61 LD65.AX LD64.AX LD63.AX LD62.AX LD61.AX | 72.39,84.45 LD29.AX LD28.AX LD27.AX LD26.AX LD25.AX LD24.AX LD23.AX LD22.AX 18.41,84.45 LD21.AX 15.24,84.45 14.61,83.82 13.97,83.19 13.97,82.55 LD60.AX 13.97,80.64 LD59.AX LD58.AX LD57.AX LD56.AX LD55.AX | LD40.AX LD39.AX LD38.AX LD37.AX LD36.AX LD35.AX LD34.AX LD33.AX LD32.AX LD31.AX 8.89,151.13 | LD8.AX LD7.AX LD6.AX LD5.AX LD4.AX LD3.AX LD2.AX LD1.AX 75.56,156.84 | 27.94,156.84 LD8.AX | LD8.AX 26.04,156.84 LD9.AX LD10.AX 14.61,156.84 | LD41.AX LD42.AX | LD50.AX 81.28,147.96 LD49.AX LD48.AX LD47.AX LD46.AX LD45.AX 81.28,112.39 | 81.28,109.86 81.28,105.41 | 76.2,83.82 75.88,83.5 | Q10.3 84.83,54.35 84.45,53.98
  Bottom 1.422: LD10.AX 26.04,156.84 | 81.28,105.41 LD43.AX | LD43.AX LD42.AX 81.28,91.44 | v6.35,87 6.35,88.9 8.89,91.44 8.89,151.13 14.61,156.84 75.56,156.84 81.28,151.13 81.28,147.96 81.28,112.39 | v12.7,87 12.7,85.72 13.97,84.45 | 13.97,84.45 14.61,83.82 | LD30.AX 72.39,84.45 18.41,84.45 15.88,84.45 | 15.88,84.45 13.97,82.55 | 13.97,82.55 13.97,80.64 13.97,23.5 15.24,22.23 LD17.AX 43.18,22.23 74.93,22.23 76.2,23.5 v76.2,53.34 76.2,54.61 LD61.AX 76.2,83.19 | 76.2,83.19 75.88,83.5 74.93,84.45 LD30.AX | 15.88,84.45 13.97,84.45 | 13.97,82.55 13.97,84.45 | v78.74,85.09 78.11,85.09 | 78.11,85.09 77.47,85.09 76.83,84.45 | 76.83,84.45 76.2,83.82 | LD30.AX 76.83,84.45 | v83.82,53.34 84.45,53.98 | 92.71,62.23 LD71.AX v92.71,85.09 | 76.2,83.19 78.11,85.09 | LD43.AX 81.28,109.86 | 81.28,109.86 LD44.AX | LD44.AX 81.28,112.39 | LD72.AX 82.55,111.12 | 82.55,111.12 LD44.AX | 82.55,111.12 81.28,112.39 | 82.55,111.12 81.28,109.86
N$20  (1 unrouted)
  Bottom 0.406: LD61.C LD62.C | 78.74,74.3 LD62.C | LD62.C LD63.C LD64.C LD65.C LD66.C LD67.C LD68.C LD69.C LD70.C
N$21
  pour Bottom (isolate 0.406): 13.97,149.86 13.97,88.9 74.93,88.9 76.2,90.17 76.2,149.86 74.93,151.13 15.24,151.13
N$22
  Bottom 0.406: R8.2 LD72.C LD71.C
  Bottom 1.422: 90.17,62.23 R8.2
N$23  (via drill 0.8)
  other vias: 55.88,121.92
N$24
  Bottom 0.406: IC1.1 55.88,121.92 57.78,123.83 R13.2
N$25
  Bottom 0.406: Q9.1 48,134.88 48.9,133.99 52.7,133.99 53.34,133.35 54.61,132.08 R9.1
N$26  (via drill 0.8)
  Top 0.406: v32.38,92.71 v32.38,80.01
  Bottom 0.406: 29.21,33.66 29.19,33.66 Q1.1 29.21,33.67 29.21,36.83 24.13,41.91 24.13,63.5 27.94,67.31 30.48,67.31 32.38,69.22 v32.38,80.01 | R10.1 28.57,96.52 v32.38,92.71
N$27
  Bottom 0.406: Q2.1 19.31,115.83 20.32,116.84 R11.1
N$28
  Bottom 0.406: Q3.1 30.22,132.34 31.11,131.44 R12.1
N$29
  Bottom 0.406: Q4.1 65.78,135 64.77,133.99 60.33,133.99 58.42,132.08 R13.1
N$30  (via drill 0.8)
  Top 0.406: v26.04,92.71 v26.04,80.01
  Bottom 0.406: R14.1 26.67,115.57 26.67,93.34 v26.04,92.71 | v26.04,80.01 27.94,80.01 29.21,78.74 29.21,75.58 Q5.1
N$31  (via drill 0.8)
  Top 0.406: v38.73,92.71 v38.73,80.01 | v61.59,73.03 v38.73,73.03
  Bottom 0.406: R15.1 31.75,99.69 v38.73,92.71 | 61.62,71.12 Q6.1 61.59,71.66 v61.59,73.03 | v38.73,73.03 v38.73,80.01
N$32  (via drill 0.8)
  Top 0.406: v72.39,139.7 v85.09,139.7
  Bottom 0.406: v85.09,139.7 86.36,139.7 87.63,138.43 87.63,137.78 Q7.1 | v72.39,139.7 72.39,133.35 70.48,131.44 R16.1
N$33
  Bottom 1.422: 74.3,19.68 15.88,19.68
N$34
  Bottom 0.406: IC1.15 53.34,113.03 58.42,118.11 58.42,121.92 60.33,121.92 R16.2
N$35  (via drill 0.8)
  Bottom 0.406: IC1.6 v43.18,121.92 43.18,125.73 41.91,127 29.21,127 28.57,126.36 R10.2
N$36
  Bottom 1.422: 11.43,24.13 11.43,82.55
N$37  (via drill 0.8)
  Bottom 0.406: R11.2 22.23,127.64 24.13,129.54 46.99,129.54 48.26,128.27 v48.26,121.92 IC1.4
N$38  (via drill 0.8)
  Bottom 0.406: IC1.3 v50.8,121.92 R12.2
N$39  (via drill 0.8)
  Bottom 0.406: IC1.2 v53.34,121.92 53.34,122.56 R9.2
N$40
  Bottom 1.422: 15.88,87 74.3,87
N$41  (via drill 0.8)
  Top 0.406: v83.19,47.62 v73.03,47.62
  Bottom 0.406: Q10.1 85.35,49.79 v83.19,47.62 | R17.2 71.75,54.61 73.03,53.34 v73.03,47.62
N$42  (via drill 0.8)
  Top 0.406: v83.82,40.64 v73.03,40.64
  Bottom 0.406: Q8.1 84.08,40.9 v83.82,40.64 | v73.03,40.64 71.12,40.64 69.85,41.91 R18.2
N$43
  Bottom 1.422: 78.74,82.55 78.74,24.13
N$44
  Bottom 1.422: 81.92,4.45 9.53,4.45
N$46
  Bottom 1.422: 21.59,76.2 20.32,77.47
N$47
  Bottom 1.422: 11.43,91.44 11.43,149.86
N$48
  Bottom 1.422: 15.88,154.31 74.3,154.31
N$49  (via drill 0.8)
  other vias: 58.42,121.92
N$50
  Bottom 0.406: SV1.7 48.26,40.01 52.07,36.2 SV2.2
N$51
  Bottom 0.406: SV1.6 50.8,40.01 54.61,36.2 SV2.3
N$52
  Bottom 0.406: SV1.5 53.34,40.01 57.15,36.2 SV2.4
N$53  (via drill 0.7)
  Top 0.406: v40.64,34.29 v47.62,34.29
  Bottom 0.406: SV1.10 v40.64,34.29 | v47.62,34.29 48.26,34.29 49.53,33.02 SV2.1
QH*  (via drill 0.8)
  Top 0.406: v45.09,92.71 v45.09,77.47 | v38.73,26.04 v38.73,13.97
  Bottom 0.406: v45.09,77.47 45.09,70.48 41.91,67.31 41.91,29.21 v38.73,26.04 | v45.09,92.71 38.1,99.69 IC1.9 | SV4.8 7.62,12.7 34.29,12.7 35.56,13.97 v38.73,13.97
RED  (via drill 0.7)
  Top 0.406: v51.44,26.04 v51.44,11.43
  Bottom 0.406: SV4.7 v51.44,11.43 54.61,11.43 55.88,12.7 85.09,12.7 SV8.7 | v51.44,26.04 45.72,31.75 SV1.8 45.72,50.8 46.99,52.07 R18.1

### Text on the board
Bottom: DVPC